# EAGLE schematic avrNetStack (EAGLE 6.3)
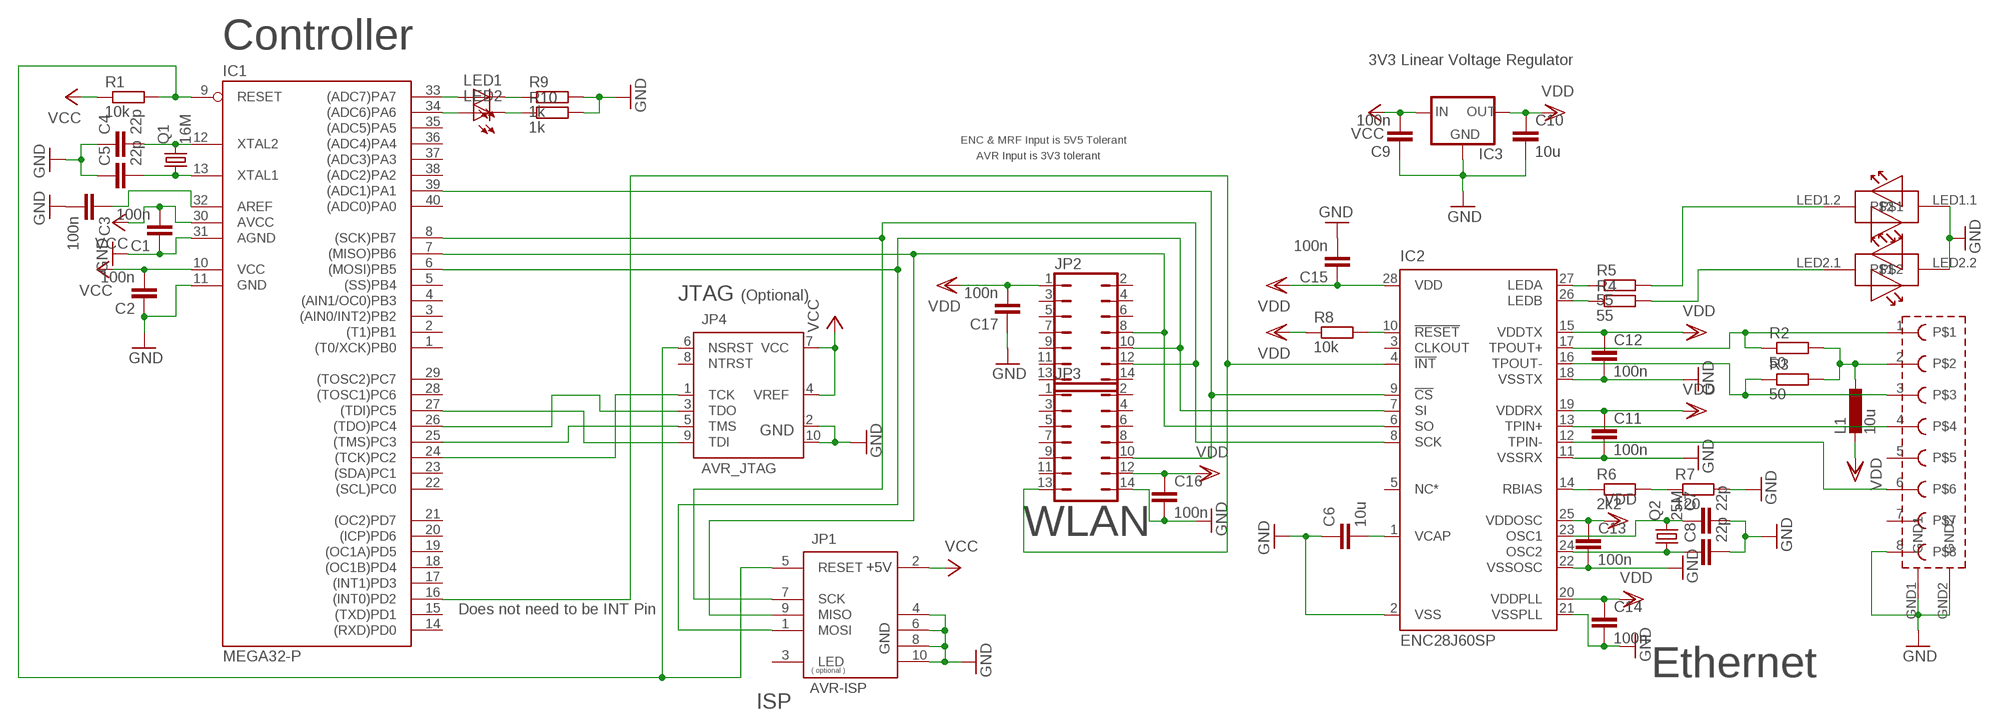
[diagram p0: schematic, sheet 1]

## Parts
C1  100n  C-EU025-030X050  [C025-030X050]
C2  100n  C-EU025-030X050  [C025-030X050]
C3  100n  C-EU025-030X050  [C025-030X050]
C4  22p  C-EU025-030X050  [C025-030X050]
C5  22p  C-EU025-030X050  [C025-030X050]
C6  10u  C-EU025-030X050  [C025-030X050]
C7  22p  C-EU025-030X050  [C025-030X050]
C8  22p  C-EU025-030X050  [C025-030X050]
C9  100n  C-EU025-030X050  [C025-030X050]
C10  10u  C-EU025-030X050  [C025-030X050]
C11  100n  C-EU025-030X050  [C025-030X050]
C12  100n  C-EU025-030X050  [C025-030X050]
C13  100n  C-EU025-030X050  [C025-030X050]
C14  100n  C-EU025-030X050  [C025-030X050]
C15  100n  C-EU025-030X050  [C025-030X050]
C16  100n  C-EU025-030X050  [C025-030X050]
C17  100n  C-EU025-030X050  [C025-030X050]
IC1  MEGA32-P  [DIL40]
IC2  ENC28J60SP  [DIL28-3]
IC3  78XXS  [78XXS]
JP1  AVR-ISP  [ML10]
JP2  JP7Q  [JP7Q]
JP3  JP7Q  [JP7Q]
JP4  AVR_JTAG  [ML10]
L1  10u  L-EU0204/7  [0204/7]
LED1  LED5MM  [LED5MM]
LED2  LED5MM  [LED5MM]
Q1  16M  CRYSTALHC49S  [HC49/S]
Q2  25M  CRYSTALHC49S  [HC49/S]
R1  10k  R-EU_0204/7  [0204/7]
R2  50  R-EU_0204/7  [0204/7]
R3  50  R-EU_0204/7  [0204/7]
R4  55  R-EU_0204/7  [0204/7]
R5  55  R-EU_0204/7  [0204/7]
R6  2k2  R-EU_0204/7  [0204/7]
R7  120  R-EU_0204/7  [0204/7]
R8  10k  R-EU_0204/7  [0204/7]
R9  1k  R-EU_0204/7  [0204/7]
R10  1k  R-EU_0204/7  [0204/7]
U$1  MAGJACK  [MAGJACK]

## Nets
GND: C1.1 C2.1 C3.2 C4.1 C5.1 C6.1 C7.2 C8.2 C9.1 C10.2 C11.2 C12.2 C13.2 C14.2 C15.2 C16.2 C17.1 IC1.11(GND) IC1.31(AGND) IC2.2(VSS) IC2.11(VSSRX) IC2.18(VSSTX) IC2.21(VSSPLL) IC2.22(VSSOSC) IC3.GND JP1.4(GND) JP1.6(GND) JP1.8(GND) JP1.10(GND) JP3.14 JP4.2(GND) JP4.10(GND) R7.2 R9.2 R10.2 U$1.8 U$1.GND1 U$1.GND2 U$1.LED1.1 U$1.LED2.2
N$1: IC1.9(RESET) JP1.5(RESET) JP4.6(NSRST) R1.2
N$2: IC1.16((INT0)PD2) IC2.4(!INT) JP3.13
N$3: C8.1 IC2.24(OSC2) Q2.1
N$4: IC1.7((MISO)PB6) IC2.6(SO) JP1.9(MISO) JP2.8
N$5: C5.2 IC1.13(XTAL1) Q1.1
N$6: C4.2 IC1.12(XTAL2) Q1.2
N$7: IC1.6((MOSI)PB5) IC2.7(SI) JP1.1(MOSI) JP2.10
N$8: IC2.17(TPOUT+) R2.1 U$1.1
N$9: IC1.34((ADC6)PA6) LED2.A
N$10: IC2.16(TPOUT-) R3.1 U$1.3
N$11: IC2.13(TPIN+) U$1.4
N$13: IC1.39((ADC1)PA1) IC2.9(!CS) JP3.10
N$14: IC1.8((SCK)PB7) IC2.8(SCK) JP1.7(SCK) JP2.12
N$15: C6.2 IC2.1(VCAP)
N$16: L1.1 R2.2 R3.2 U$1.2
N$17: IC2.12(TPIN-) U$1.6
N$18: IC1.33((ADC7)PA7) LED1.A
N$19: R4.2 U$1.LED2.1
N$20: R5.2 U$1.LED1.2
N$21: C7.1 IC2.23(OSC1) Q2.2
N$22: IC2.26(LEDB) R4.1
N$23: IC2.27(LEDA) R5.1
N$24: IC2.14(RBIAS) R6.1
N$25: R6.2 R7.1
N$26: IC2.10(!RESET) R8.2
N$27: LED1.K(C) R9.1
N$28: LED2.K(C) R10.1
N$29: IC1.27((TDI)PC5) JP4.9(TDI)
N$30: IC1.25((TMS)PC3) JP4.5(TMS)
N$31: IC1.26((TDO)PC4) JP4.3(TDO)
N$32: IC1.24((TCK)PC2) JP4.1(TCK)
N$34: C3.1 IC1.32(AREF)
VCC: C1.2 C2.2 C9.2 IC1.10(VCC) IC1.30(AVCC) IC3.IN JP1.2(+5V) JP4.4(VREF) JP4.7(VCC) R1.1
VDD: C10.1 C11.1 C12.1 C13.1 C14.1 C15.1 C16.1 C17.2 IC2.15(VDDTX) IC2.19(VDDRX) IC2.20(VDDPLL) IC2.25(VDDOSC) IC2.28(VDD) IC3.OUT JP2.1 JP3.12 L1.2 R8.1
Unconnected: IC1.1((T0/XCK)PB0) IC1.2((T1)PB1) IC1.3((AIN0/INT2)PB2) IC1.4((AIN1/OC0)PB3) IC1.5((SS)PB4) IC1.14((RXD)PD0) IC1.15((TXD)PD1) IC1.17((INT1)PD3) IC1.18((OC1B)PD4) IC1.19((OC1A)PD5) IC1.20((ICP)PD6) IC1.21((OC2)PD7) IC1.22((SCL)PC0) IC1.23((SDA)PC1) IC1.28((TOSC1)PC6) IC1.29((TOSC2)PC7) IC1.35((ADC5)PA5) IC1.36((ADC4)PA4) IC1.37((ADC3)PA3) IC1.38((ADC2)PA2) IC1.40((ADC0)PA0) IC2.3(CLKOUT) IC2.5(NC*) JP1.3(LED) JP2.2 JP2.3 JP2.4 JP2.5 JP2.6 JP2.7 JP2.9 JP2.11 JP2.13 JP2.14 JP3.1 JP3.2 JP3.3 JP3.4 JP3.5 JP3.6 JP3.7 JP3.8 JP3.9 JP3.11 JP4.8(NTRST) U$1.5 U$1.7

## Notes on the sheet
- Controller
- 3V3 Linear Voltage Regulator
- ENC & MRF Input is 5V5 Tolerant
- AVR Input is 3V3 tolerant
- JTAG | (Optional)
- WLAN
- Does not need to be INT Pin
- Ethernet
- ISP

## Library data of the parts
C1-C17 = resistor:C-EU: CAPACITOR, European symbol
IC1 = avr-7:MEGA32-P: MICROCONTROLLER 32 Kbytes FLASH 2 Kbytes SRAM 1 Kbytes EEPROM USART 8-channel 10 bit ADC
IC2 = microchip:ENC28J60: Stand-Alone Ethernet Controller with SPI Interface Source: http://ww1.microchip.com/downloads/en/DeviceDoc/39662c.pdf; MF: MICROCHIP; MPN: ENC28J60/SP; OC_FARNELL: 1084619; OC_NEWARK: 96K3661
IC3 = v-reg:78XXS: VOLTAGE REGULATOR
JP1 = 0_RN:AVR-ISP: ISP ( In System Programming ) Stecker für AVRs Über diesen Anschluß kann ein AVR mit einem Standard ISP-Kabel direkt an einen Parallelport des PC´s angeschlossen und programmiert werden. Die Belegung des ISP-Anschlusses ist zu dem weit verbreitetet STK200 Programmier Dongle kompatibel. Ein entsprechender Dongle ist über zahlreiche Händler lieferbar. Es gibt aber auch viele Selbstbauanleitungen im Internet.
JP2 JP3 = jumper:JP7Q: JUMPER
JP4 = 0_RN:AVR_JTAG: AVR JTAG Adapter Zum Programmieren/Simulieren von AVRs in der Schaltung
L1 = resistor:L-EU: INDUCTOR, European symbol
LED1 LED2 = led:LED: LED OSRAM: - CHIPLED LG R971, LG N971, LY N971, LG Q971, LY Q971, LO R971, LY R971 LH N974, LH R974 LS Q976, LO Q976, LY Q976 LO Q996 - Hyper CHIPLED LW Q18S LB Q993, LB Q99A, LB R99A - SideLED LS A670, LO A670, LY A670, LG A670, LP A670 LB A673, LV A673, LT A673, LW A673 LH A674 LY A675 LS A676, LA A676, LO A676, LY A676, LW A676 LS A679, LY A679, LG A679 - Hyper Micro SIDELED® LS Y876, LA Y876, LO Y876, LY Y876 LT Y87S - SmartLED LW L88C, LW L88S LB L89C, LB L89S, LG L890 LS L89K, LO L89K, LY L89K LS L896, LA L896, LO L896, LY L896 - TOPLED LS T670, LO T670, LY T670, LG T670, LP T670 LSG T670, LSP T670, LSY T670, LOP T670, LYG T670 LG T671, LOG T671, LSG T671 LB T673, LV T673, LT T673, LW T673 LH T674 LS T676, LA T676, LO T676, LY T676, LB T676, LH T676, LSB T676, LW T676 LB T67C, LV T67C, LT T67C, LS T67K, LO T67K, LY T67K, LW E67C LS E67B, LA E67B, LO E67B, LY E67B, LB E67C, LV E67C, LT E67C LW T67C LS T679, LY T679, LG T679 LS T770, LO T770, LY T770, LG T770, LP T770 LB T773, LV T773, LT T773, LW T773 LH T774 LS E675, LA E675, LY E675, LS T675 LS T776, LA T776, LO T776, LY T776, LB T776 LHGB T686 LT T68C, LB T68C - Hyper Mini TOPLED® LB M676 - Mini TOPLED Santana® LG M470 LS M47K, LO M47K, LY M47K Source: http://www.osram.convergy.de LUXEON: - LUMILED® LXK2-PW12-R00, LXK2-PW12-S00, LXK2-PW14-U00, LXK2-PW14-V00 LXK2-PM12-R00, LXK2-PM12-S00, LXK2-PM14-U00 LXK2-PE12-Q00, LXK2-PE12-R00, LXK2-PE12-S00, LXK2-PE14-T00, LXK2-PE14-U00 LXK2-PB12-K00, LXK2-PB12-L00, LXK2-PB12-M00, LXK2-PB14-N00, LXK2-PB14-P00, LXK2-PB14-Q00 LXK2-PR12-L00, LXK2-PR12-M00, LXK2-PR14-Q00, LXK2-PR14-R00 LXK2-PD12-Q00, LXK2-PD12-R00, LXK2-PD12-S00 LXK2-PH12-R00, LXK2-PH12-S00 LXK2-PL12-P00, LXK2-PL12-Q00, LXK2-PL12-R00 Source: www.luxeon.com KINGBRIGHT: KA-3528ASYC Source: www.kingbright.com
Q1 Q2 = crystal:CRYSTAL: CRYSTAL; OC_FARNELL: 1667008; OC_NEWARK: unknown
R1-R10 = resistor:R-EU_: RESISTOR, European symbol
U$1 = 0_magjacksmalldrill:MAGJACK: MagJack RJ45 Connector. Matches: SI-60024 SI-40138 SI-40139 SI-40140 Not compatible with RJLD-043TC!